# EAGLE design NG3ControllerBoard (EAGLE 9.6.1)
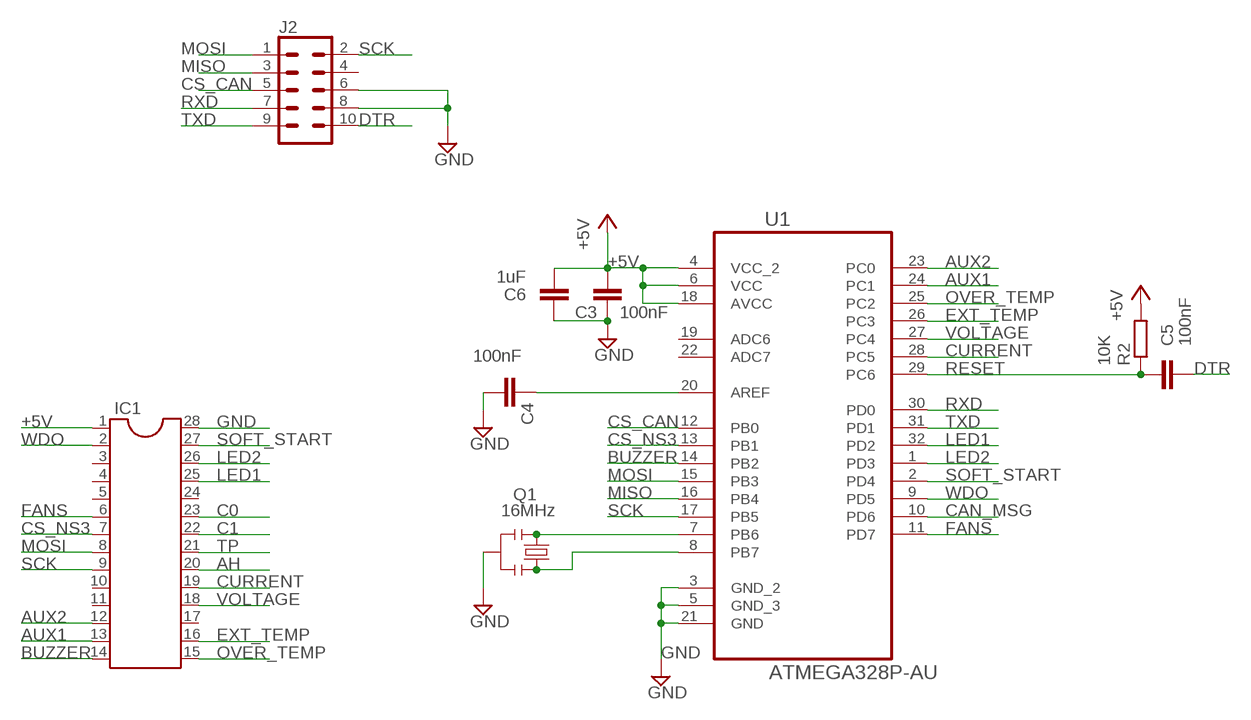
[diagram p0: schematic, sheet 1]

## Parts
C3  100nF  C-EUC0603  [C0603]
C4  100nF  C-EUC0603  [C0603]
C5  100nF  C-EUC0603  [C0603]
C6  1uF  C-EUC0805  [C0805]
IC1  DIL28  [DIL28-6]
J2  CONN_05X2PTH  [2X5]
Q1  16MHz  RESONATORSMD  [RESONATOR-SMD]
R2  10K  R-EU_R0603  [R0603]
U1  ATMEGA328P-AU  [QFP80P900X900X120-32N]

## Nets
+5V: C3.2 C6.2 IC1.1 R2.2 U1.4(VCC_2) U1.6(VCC) U1.18(AVCC)
AH: IC1.20
AUX1: IC1.13 U1.24(PC1)
AUX2: IC1.12 U1.23(PC0)
BUZZER: IC1.14 U1.14(PB2)
C0: IC1.23
C1: IC1.22
CAN_MSG: U1.10(PD6)
CS_CAN: J2.5 U1.12(PB0)
CS_NS3: IC1.7 U1.13(PB1)
CURRENT: IC1.19 U1.28(PC5)
DTR: C5.2 J2.10
EXT_TEMP: IC1.16 U1.26(PC3)
FANS: IC1.6 U1.11(PD7)
GND: C3.1 C4.2 C6.1 IC1.28 J2.6 J2.8 Q1.2 U1.3(GND_2) U1.5(GND_3) U1.21(GND)
LED1: IC1.25 U1.32(PD2)
LED2: IC1.26 U1.1(PD3)
MISO: J2.3 U1.16(PB4)
MOSI: IC1.8 J2.1 U1.15(PB3)
N$2: Q1.1 U1.7(PB6)
N$3: Q1.3 U1.8(PB7)
N$8: C4.1 U1.20(AREF)
OVER_TEMP: IC1.15 U1.25(PC2)
RESET: C5.1 R2.1 U1.29(PC6)
RXD: J2.7 U1.30(PD0)
SCK: IC1.9 J2.2 U1.17(PB5)
SOFT_START: IC1.27 U1.2(PD4)
TP: IC1.21
TXD: J2.9 U1.31(PD1)
VOLTAGE: IC1.18 U1.27(PC4)
WDO: IC1.2 U1.9(PD5)
Unconnected: IC1.3 IC1.4 IC1.5 IC1.10 IC1.11 IC1.17 IC1.24 J2.4 U1.19(ADC6) U1.22(ADC7)

## Library data of the parts
C3-C6 = rcl:C-EU: CAPACITOR, European symbol; SPICEPREFIX: C
IC1 = ic-package:DIL28: Dual In Line
J2 = SparkFun-Connectors:CONN_05X2: Multi connection point. Often used as Generic Header-pin footprint for 0.1 inch spaced/style header connections For AVR SPI programming port, see special device with nice symbol: "AVR_SPI_PROG_5x2.dev" You can populate with any combo of single row headers, but if you'd like an exact match, check these: 2x5 AVR ICSP Male Header <https://www.sparkfun.com/products/778> (PRT-00778) 2x5 Pin Shrouded Header <https://www.sparkfun.com/products/8506> (PRT-08506) On any of the 0.1 inch spaced packages, you can populate with these: Break Away Headers - Straight <https://www.sparkfun.com/products/116> (PRT-00116) Break Away Male Headers - Right Angle <https://www.sparkfun.com/products/553> (PRT-00553) Female Headers <https://www.sparkfun.com/products/115> (PRT-00115) Break Away Headers - Machine Pin <https://www.sparkfun.com/products/117> (PRT-00117) Break Away Female Headers - Swiss Machine Pin <https://www.sparkfun.com/products/743> (PRT-00743) Special note: the shrouded connector mates well with our 5x2 ribbon cables: 2x5 Pin IDC Ribbon Cable <https://www.sparkfun.com/products/8535> (PRT-08535); PROD_ID: CONN-08499; SF_ID: PRT-0778
Q1 = SparkFun:RESONATOR: Resonator Small SMD resonator. This is the itty bitty 10/20MHz resonators with built in caps. CSTCE10M0G55 and CSTCE20M0V53. Footprint has been reviewed closely but hasn't been tested yet.
R2 = rcl:R-EU_: RESISTOR, European symbol; SPICEPREFIX: R
U1 = Atmel_By_element14_Batch_1-00:ATMEGA328P-AU: 8-bit Microcontroller with In-System Programmable Flash; MPN: ATMEGA328P-AU; OC_FARNELL: 1715486; OC_NEWARK: 14R4631; PACKAGE: TQFP-32; SUPPLIER: Atmel

## Board
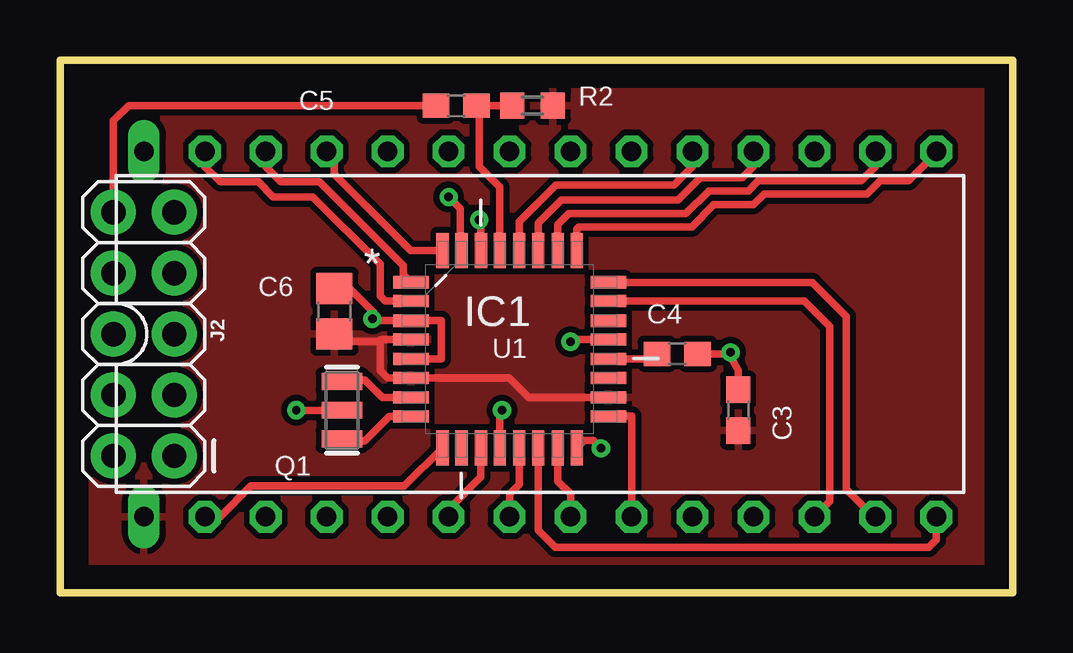
[diagram p1: board, top side]
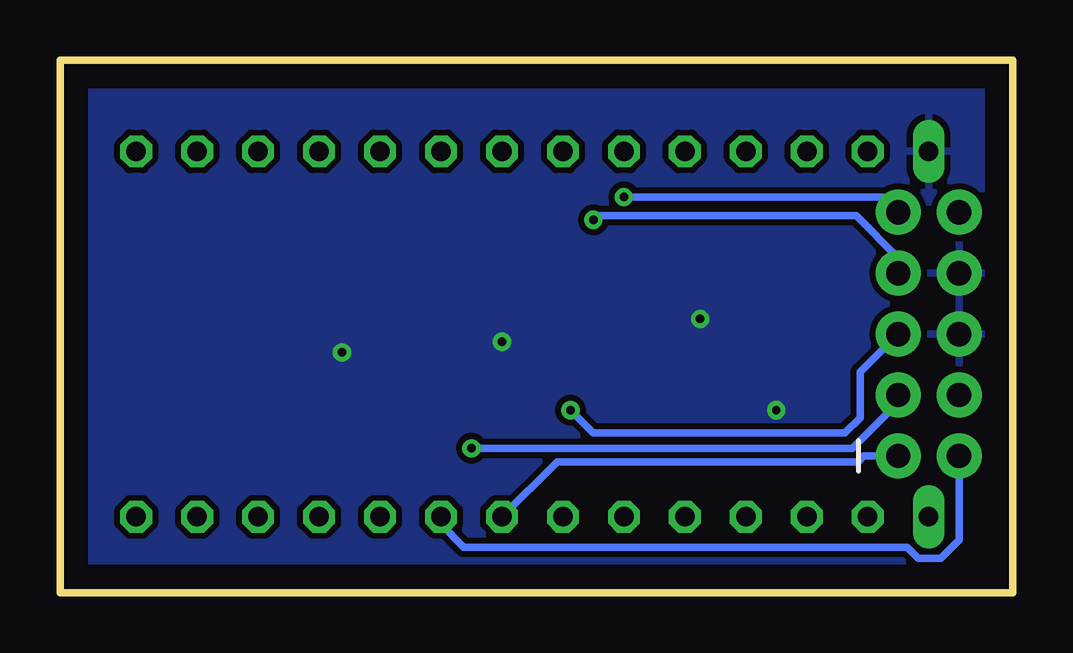
[diagram p2: board, bottom side, seen from below]

Size 39.69 x 22.23 mm. Coordinates in mm from the lower left corner, seen from the top.
Outline: 0,0 39.69,0 39.69,22.23 0,22.23 0,0
Copper layers (1*16): Top 0.035mm / dielectric 1.5mm / Bottom 0.035mm
Design rules "default *": minimum track width 6mil, minimum drill 0.35mm, track to track 10mil, track to pad 10mil, pad to pad 10mil, via to via 10mil, smd to smd 6mil, copper to edge 40mil, drill to drill 6mil, minimum pad ring 10mil, minimum via ring 8mil, stop-mask expansion 0.1516mm, vias tented up to drill 0mil, thermal gap 10mil

### Footprints (pad centres in the part's own frame; a part is rotated, then mirrored left to right if it is on the bottom)
C0603 = smd 1.1 x 1: 1 -0.85,0; 2 0.85,0
C0805 = smd 1.3 x 1.5: 1 -0.95,0; 2 0.95,0
DIL28-6 = drill 0.813 long: 1 -16.51,-7.62; 28 -16.51,7.62 | drill 0.813 octagon: 2 -13.97,-7.62; 3 -11.43,-7.62; 4 -8.89,-7.62; 5 -6.35,-7.62; 6 -3.81,-7.62; 7 -1.27,-7.62; 8 1.27,-7.62; 9 3.81,-7.62; 10 6.35,-7.62; 11 8.89,-7.62; 12 11.43,-7.62; 13 13.97,-7.62; 14 16.51,-7.62; 15 16.51,7.62; 16 13.97,7.62; 17 11.43,7.62; 18 8.89,7.62; 19 6.35,7.62; 20 3.81,7.62; 21 1.27,7.62; 22 -1.27,7.62; 23 -3.81,7.62; 24 -6.35,7.62; 25 -8.89,7.62; 26 -11.43,7.62; 27 -13.97,7.62
2X5 = drill 1.016 pad 1.88: 1 0,0; 2 0,2.54; 3 2.54,0; 4 2.54,2.54; 5 5.08,0; 6 5.08,2.54; 7 7.62,0; 8 7.62,2.54; 9 10.16,0; 10 10.16,2.54
RESONATOR-SMD = smd 0.7 x 1.7: 1 -1.2,0; 2 0,0; 3 1.2,0
R0603 = smd 1 x 1.1: 1 -0.85,0; 2 0.85,0
QFP80P900X900X120-32N = smd 1.473 x 0.508: 1 -4.115,2.794; 2 -4.115,2.007; 3 -4.115,1.194; 4 -4.115,0.406; 5 -4.115,-0.406; 6 -4.115,-1.194; 7 -4.115,-2.007; 8 -4.115,-2.794; 17 4.115,-2.794; 18 4.115,-2.007; 19 4.115,-1.194; 20 4.115,-0.406; 21 4.115,0.406; 22 4.115,1.194; 23 4.115,2.007; 24 4.115,2.794 | smd 0.508 x 1.473: 9 -2.794,-4.115; 10 -2.007,-4.115; 11 -1.194,-4.115; 12 -0.406,-4.115; 13 0.406,-4.115; 14 1.194,-4.115; 15 2.007,-4.115; 16 2.794,-4.115; 25 2.794,4.115; 26 2.007,4.115; 27 1.194,4.115; 28 0.406,4.115; 29 -0.406,4.115; 30 -1.194,4.115; 31 -2.007,4.115; 32 -2.794,4.115

### Placement (x,y rotation side)
C3  28.26,7.62 270 top
C4  25.72,9.97 0 top
C5  16.51,20.32 180 top
C6  11.43,11.75 270 top
IC1  20,10.79 0 top
J2  4.76,5.71 90 top
Q1  11.75,7.62 270 top
R2  19.69,20.32 0 top
U1  18.73,10.16 0 top

### Tracks (layer width: path | path; a pad name or v marks a point on that pad's centre or on a via)
+5V
  Top 0.305: U1.4 13.42,10.57 13.37,10.52 13.34,10.55 | C6.2 11.75,10.48 13.34,10.48 13.34,9.28 13.65,8.97 U1.6 18.72,8.97 19.53,8.15 U1.18
  pour Top: 0.95,0.64 0.95,21.27 39.05,21.27 39.05,0.64
AUX1
  Top 0.305: U1.24 31.33,12.95 32.75,11.53 32.75,4.32 33.9,3.17 IC1.13
AUX2
  Top 0.305: U1.23 31.01,12.17 32.07,11.11 32.07,3.81 IC1.12
BUZZER
  Top 0.305: U1.14 19.93,2.62 20.64,1.91 36.19,1.91 36.51,2.22 IC1.14
CS_CAN  (via drill 0.35)
  Top 0.305: U1.12 18.33,7.53 v18.41,7.62
  Bottom 0.305: J2.5 6.35,9.21 6.35,7.3 6.98,6.67 17.46,6.67 v18.41,7.62
CS_NS3
  Top 0.305: U1.13 19.14,4.53 18.73,4.13 IC1.7
CURRENT
  Top 0.305: IC1.19 26.35,17.78 25.58,17.01 20.65,17.01 19.14,15.49 U1.28
DTR
  Top 0.305: C5.2 2.86,20.32 2.22,19.69 J2.10
EXT_TEMP
  Top 0.305: U1.26 20.74,15.37 21.19,15.82 26.08,15.82 27.02,16.76 28.67,16.76 29.1,17.2 33.39,17.2 33.97,17.78 IC1.16
FANS
  Top 0.305: U1.11 17.54,4.84 16.19,3.49 IC1.6
GND  (via drill 0.35)
  Top 0.152: U1.3 14.57,11.4 14.57,11.35
  Top 0.305: U1.3 15.87,11.35 15.87,9.75 U1.5 | U1.21 21.36,10.57 v21.27,10.48 | C4.2 27.88,9.97 v27.94,10.03 27.94,9.84 28.26,9.28 C3.1 | 13.09,11.35 v13.02,11.43 | U1.3 | U1.3 14.57,11.35 13.09,11.35 | 11.53,12.6 C6.1 12.07,12.7 13.09,11.67 13.09,11.35 | v9.84,7.62 Q1.2
  pour Bottom: 0.95,0.64 39.05,0.64 39.05,21.27 0.95,21.27
LED1
  Top 0.305: IC1.25 11.43,18.1 11.43,17.46 14.6,14.29 15.93,14.29 U1.32
LED2
  Top 0.305: U1.1 14.3,13.27 14.3,13.65 10.81,17.15 9.21,17.15 8.57,17.78 IC1.26
MISO  (via drill 0.35)
  Top 0.305: U1.16 21.84,6.36 22.21,6.36 v22.54,6.03
  Bottom 0.305: J2.3 4.76,7.94 6.67,6.03 v22.54,6.03
MOSI
  Top 0.152: 20.87,6.12 U1.15
  Top 0.305: U1.15 | U1.15 20.74,4.66 21.27,4.13 IC1.8
  Bottom 0.305: IC1.8 18.97,5.47 6.44,5.47 6.19,5.71 J2.1
N$2
  Top 0.305: U1.7 13.44,8.15 12.7,8.89 11.82,8.89 Q1.1
N$3
  Top 0.305: U1.8 13.72,7.37 12.7,6.35 11.82,6.35 Q1.3
N$8
  Top 0.305: C4.1 24.51,9.75 U1.20
OVER_TEMP
  Top 0.152: 21.48,14.25 U1.25
  Top 0.305: U1.25 | U1.25 21.53,15.18 21.62,15.27 26.31,15.27 27.24,16.19 28.89,16.19 29.34,16.64 33.62,16.64 34.18,17.2 35.37,17.2 36.51,18.34 IC1.15
RESET
  Top 0.305: R2.1 C5.1 17.46,20.22 17.46,17.78 18.33,16.92 U1.29
RXD  (via drill 0.35)
  Top 0.305: 17.46,14.35 U1.30 17.54,15.48 v17.46,15.56
  Bottom 0.305: v17.46,15.56 17.29,15.72 6.52,15.72 4.76,13.97 J2.7
SCK
  Top 0.305: U1.17 22.86,7.38 23.81,7.38 IC1.9
  Bottom 0.305: IC1.9 23.81,2.86 22.86,1.91 4.39,1.91 3.93,1.45 3,1.45 2.22,2.22 J2.2
SOFT_START
  Top 0.305: U1.2 13.55,12.17 13.34,12.38 13.34,13.72 10.54,16.51 8.89,16.51 8.26,17.15 6.67,17.15 6.03,17.78 IC1.27
TXD  (via drill 0.35)
  Top 0.305: U1.31 16.73,14.87 16.68,14.91 16.68,16.03 v16.19,16.51
  Bottom 0.305: v16.19,16.51 5.4,16.51 J2.9
VOLTAGE
  Top 0.305: U1.27 19.93,15.42 20.89,16.38 25.75,16.38 26.69,17.32 28.44,17.32 28.89,17.78 IC1.18
WDO
  Top 0.305: U1.9 14.35,4.46 7.95,4.46 6.67,3.17 IC1.2